# Altium project Brain_Stimulator.PrjPcb (part 2 of 2)

## Sheet Four_DDS.SchDoc
size A; SheetNumber: 11; SheetTotal: 16
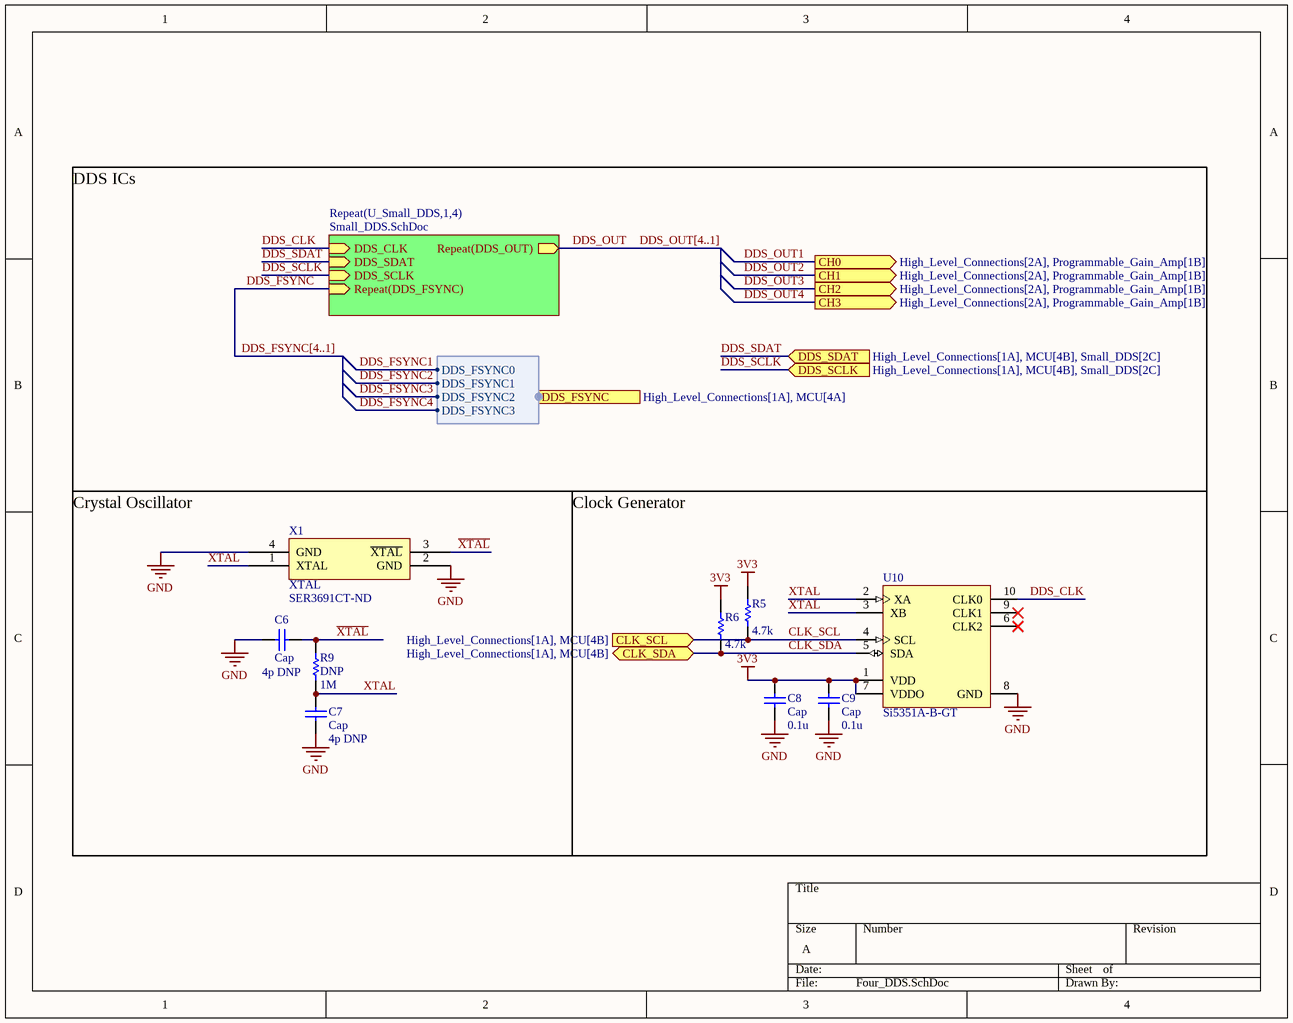
[diagram p11: Four_DDS.SchDoc]

### Parts
(Parts that share a designator on the sheet are numbered #1, #2 ... from top to bottom, then left to right.)
C6#2  Cap  value 4p DNP  [0402_Res]
C7#2  Cap  value 4p DNP  [0402_Res]
C8#2  Cap  value 0.1u  [0402_Res]
C9#2  Cap  value 0.1u  [0402_Res]
R5#2  value 4.7k  [0402_Res]  (hidden comment: DNP)
R6#2  value 4.7k  [0402_Res]  (hidden comment: DNP)
R9  DNP  value 1M  [0402_Res]
U10  Si5351A-B-GT  [SLAB-MSOP-10_N]
X1#2  XTAL  Supplier Part Number 1: SER3691CT-ND  [XTAL_Basic]

### Blocks framed on the sheet
Clock Generator: C8#2 C9#2 R5#2 R6#2 U10

### Sub-sheets
Repeat(U_Small_DDS,1,4) = Small_DDS.SchDoc: DDS_CLK (in), DDS_SDAT (in), DDS_SCLK (in), Repeat(DDS_FSYNC) (in), Repeat(DDS_OUT) (out)

### Ports
CH0 (out, see High_Level_Connections[2A], Programmable_Gain_Amp[1B]), CH1 (out, see High_Level_Connections[2A], Programmable_Gain_Amp[1B]), CH2 (out, see High_Level_Connections[2A], Programmable_Gain_Amp[1B]), CH3 (out, see High_Level_Connections[2A], Programmable_Gain_Amp[1B]), CLK_SCL (in, see High_Level_Connections[1A], MCU[4B]), CLK_SDA (bidir, see High_Level_Connections[1A], MCU[4B]), DDS_FSYNC (harness DDS_FSYNC, see High_Level_Connections[1A], MCU[4A]), DDS_SCLK (in, see High_Level_Connections[1A], MCU[4B], Small_DDS[2C]), DDS_SDAT (in, see High_Level_Connections[1A], MCU[4B], Small_DDS[2C])

### Harnesses
DDS_FSYNC: DDS_FSYNC0, DDS_FSYNC1, DDS_FSYNC2, DDS_FSYNC3

### Nets
3V3: C8#2.2 C9#2.2 R5#2.2 R6#2.2 U10.1(VDD) U10.7(VDDO)
GND: C6#2.1 C7#2.1 C8#2.1 C9#2.1 U10.8(GND) X1#2.2(GND) X1#2.4(GND)
~{XTAL}: C6#2.2 R9.2 U10.3(XB) X1#2.3(~{XTAL})
CLK_SCL: R5#2.1 U10.4(SCL) ; port CLK_SCL
CLK_SDA: R6#2.1 U10.5(SDA) ; port CLK_SDA
DDS_CLK: U10.10(CLK0) ; sheet Repeat(U_Small_DDS,1,4)/DDS_CLK
DDS_FSYNC: sheet Repeat(U_Small_DDS,1,4)/Repeat(DDS_FSYNC)
DDS_OUT: sheet Repeat(U_Small_DDS,1,4)/Repeat(DDS_OUT)
DDS_OUT1: port CH0
DDS_OUT2: port CH1
DDS_OUT3: port CH2
DDS_OUT4: port CH3
DDS_SCLK: port DDS_SCLK, sheet Repeat(U_Small_DDS,1,4)/DDS_SCLK
DDS_SDAT: port DDS_SDAT, sheet Repeat(U_Small_DDS,1,4)/DDS_SDAT
XTAL: C7#2.2 R9.1 U10.2(XA) X1#2.1(XTAL)

Not connected (* = marked no-connect by the designer): U10 6(CLK2)* 9(CLK1)*

### Buses and harness runs
bus DDS_FSYNC[4..1]
bus DDS_OUT[4..1]

### Notes on the sheet
- DDS ICs
- Crystal Oscillator

### Library data of the parts
C6#2 C7#2 C8#2 C9#2 = Cap: Capacitor; Published: 8-Jun-2000; LatestRevisionDate: 17-Jul-2002; LatestRevisionNote: Re-released for DXP Platform.; PackageReference: RAD-0.3; Publisher: Altium Limited; PackageDescription: Radial Cap, Thru-Hole; 2 Leads; 0.3 in Pin Spacing
R5#2 R6#2 R9 = Res1: Resistor; Published: 8-Jun-2000; LatestRevisionDate: 17-Jul-2002; LatestRevisionNote: Re-released for DXP Platform.; PackageReference: AXIAL-0.3; Publisher: Altium Limited; PackageDescription: Axial Device, Thru-Hole; 2 Leads; 0.3 in Pin Spacing
U10 = CMP-0510-00012-1: I2C-Programmable Any-Frequency CMOS Clock Generator + VCXO, 2.5 / 3.3 V, 0.008 to 160 MHz Output, -40 to 85 degC, 10-pin SOP; Manufacturer: Silicon Labs; Sub-Family: Clock Generators; VDD: 2.5 V; 3.3 V; Output Format: LVCMOS; Reference Inputs: 1; ComponentLink1URL: http://www.silabs.com/; Code_JEDEC: MO-187; PackageDescription: 10-Pin Mini Small Outline Package, Body 3 x 3 mm, Pitch 0.5 mm; Output Frequency (MHz): 0.008 to 160; ComponentLink3Description: Package Specification; DatasheetVersion: Rev. 0.95; PartNumber: Si5351A-B-GT; ComponentLink1Description: Manufacturer URL; Code_IPC: J-STD-020; Mounting Technology: Surface Mount; ComponentLink2Description: Datasheet; PackageReference: MSOP-10; ComponentLink2URL: http://www.silabs.com/Support%20Documents/TechnicalDocs/Si5351.pdf; ComponentLink3URL: http://www.silabs.com/Support Documents/TechnicalDocs/C8051T60x.pdf
X1#2 = XTAL: ComponentLink1Description: New link; ComponentLink1URL: *; Supplier 1: DigiKey

## Sheet Small_DDS.SchDoc
size A; SheetNumber: 12; SheetTotal: 16
Used 4 times, as channels U_High_Level_Connections/U_Four_DDS/U_Small_DDS1, U_High_Level_Connections/U_Four_DDS/U_Small_DDS2, U_High_Level_Connections/U_Four_DDS/U_Small_DDS3, U_High_Level_Connections/U_Four_DDS/U_Small_DDS4. Parts and nets are listed once, with the designators drawn on the sheet.
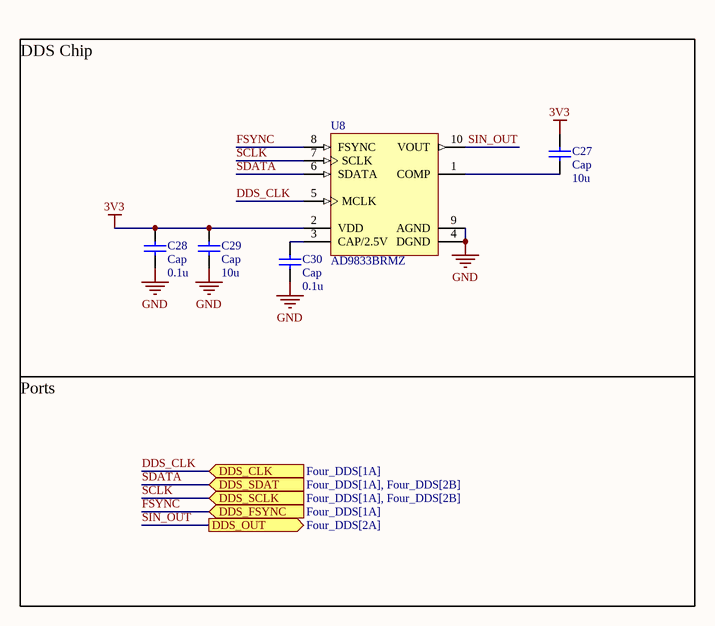
[diagram p12: Small_DDS.SchDoc]

### Parts
C27  Cap  value 10u  [0402_Res]
C28  Cap  value 0.1u  [0402_Res]
C29  Cap  value 10u  [0402_Res]
C30  Cap  value 0.1u  [0402_Res]
U8  AD9833BRMZ  [ADI-RM-10_M]

### Ports
DDS_CLK (in, see Four_DDS[1A]), DDS_FSYNC (in, see Four_DDS[1A]), DDS_OUT (out, see Four_DDS[2A]), DDS_SCLK (in, see Four_DDS[1A], Four_DDS[2B]), DDS_SDAT (in, see Four_DDS[1A], Four_DDS[2B])

### Nets
3V3: C27.2 C28.2 C29.2 U8.2(VDD)
GND: C28.1 C29.1 C30.1 U8.4(DGND) U8.9(AGND)
DDS_CLK: U8.5(MCLK) ; port DDS_CLK
FSYNC: U8.8(FSYNC) ; port DDS_FSYNC
SCLK: U8.7(SCLK) ; port DDS_SCLK
SDATA: U8.6(SDATA) ; port DDS_SDAT
SIN_OUT: U8.10(VOUT) ; port DDS_OUT
NetC27_1: C27.1 U8.1(COMP)
NetC30_2: C30.2 U8.3(CAP/2.5V)

### Channels
U_High_Level_Connections/U_Four_DDS/U_Small_DDS1: designators end in _U_Small_DDS1; ports DDS_CLK=DDS_CLK DDS_FSYNC=FSYNC DDS_OUT=SIN_OUT DDS_SCLK=DDS_SCLK DDS_SDAT=DDS_SDAT
U_High_Level_Connections/U_Four_DDS/U_Small_DDS2: designators end in _U_Small_DDS2; ports DDS_CLK=DDS_CLK DDS_FSYNC=FSYNC DDS_OUT=SIN_OUT DDS_SCLK=DDS_SCLK DDS_SDAT=DDS_SDAT
U_High_Level_Connections/U_Four_DDS/U_Small_DDS3: designators end in _U_Small_DDS3; ports DDS_CLK=DDS_CLK DDS_FSYNC=FSYNC DDS_OUT=SIN_OUT DDS_SCLK=DDS_SCLK DDS_SDAT=DDS_SDAT
U_High_Level_Connections/U_Four_DDS/U_Small_DDS4: designators end in _U_Small_DDS4; ports DDS_CLK=DDS_CLK DDS_FSYNC=FSYNC DDS_OUT=SIN_OUT DDS_SCLK=DDS_SCLK DDS_SDAT=DDS_SDAT

### Notes on the sheet
- DDS Chip
- Ports

### Library data of the parts
C27-C30 = Cap: Capacitor; Published: 8-Jun-2000; LatestRevisionDate: 17-Jul-2002; LatestRevisionNote: Re-released for DXP Platform.; PackageReference: RAD-0.3; Publisher: Altium Limited; PackageDescription: Radial Cap, Thru-Hole; 2 Leads; 0.3 in Pin Spacing
U8 = CMP-0293-00077-1: Low Power, 12.65 mW, 2.3 V to 5.5 V, Programmable Waveform Generator, 10-Bit, Serial, RM-10, 50 Tube, Pb-Free; Resolution (Bits): 10bit; Compliance Range (V): 650mV; FS Iout (mA nom): 3mA; REFCLK Multiplier: No; Master fclk: 25MHz; I Supply total (max): 5.5mA; Tuning Word Width (bits): 28bit; Code_JEDEC: MO-187-BA; DatasheetVersion: Rev. D; PackageVersion: 5/8/2005; ComponentLink1URL: www.analog.com; ComponentLink3Description: Package Specification; PackageDescription: 10-Lead Mini Small Outline Package [MSOP]; I/O Interface: Serial; ComponentLink2Description: Datasheet; ComponentLink1Description: Manufacturer URL; PackageReference: RM-10; ComponentLink2URL: http://www.analog.com/static/imported-files/data_sheets/AD9833.pdf; ComponentLink3URL: http://www.analog.com/static/imported-files/packages/PKG_PDF/MSOP%28RM%29/RM_10.pdf

## Sheet Curr_Source_Buffer.SchDoc
size A; SheetNumber: 15; SheetTotal: 16
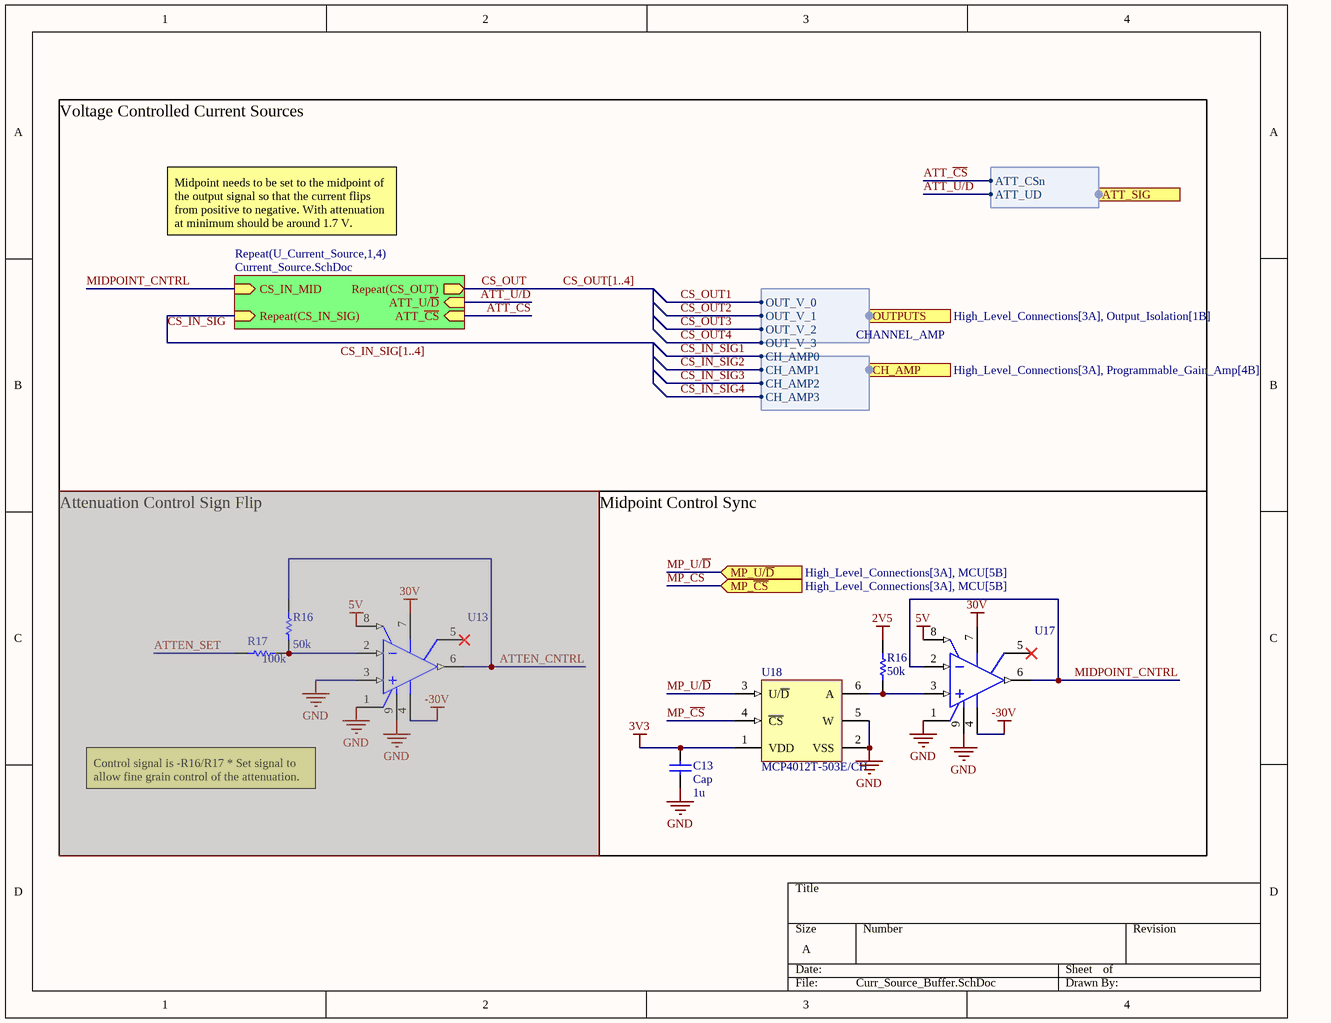
[diagram p13: Curr_Source_Buffer.SchDoc]

### Parts
(Parts that share a designator on the sheet are numbered #1, #2 ... from top to bottom, then left to right.)
C13#2  Cap  value 1u  [CAPC1608X05N]
R16#1  value 50k  [0402_Res]  (hidden comment: DNP)  (masked out: inside a compile mask, not in the netlist)
R16#2  value 50k  [0402_Res]  (hidden comment: DNP)
R17  value 100k  [0402_Res]  (hidden comment: DNP)  (masked out: inside a compile mask, not in the netlist)
U13#2  OPA454AIDDA  [DDA0008C_L]  (value not drawn)  (masked out: inside a compile mask, not in the netlist)
U17  OPA454AIDDA  [DDA0008C_L]  (value not drawn)
U18  MCP4012T-503E/CH  [SOT-23-CH6_M]

### Blocks framed on the sheet
Midpoint Control Sync: C13#2 R16#2 U17 U18

### Sub-sheets
Repeat(U_Current_Source,1,4) = Current_Source.SchDoc: CS_IN_MID (in), Repeat(CS_OUT) (out), Repeat(CS_IN_SIG) (in), ATT_U/~{D} (in), ATT_~{CS} (in)

### Ports
ATT_SIG (harness ATT), CH_AMP (in, harness CHANNEL_AMP, see High_Level_Connections[3A], Programmable_Gain_Amp[4B]), MP_U/~{D} (in, see High_Level_Connections[3A], MCU[5B]), MP_~{CS} (in, see High_Level_Connections[3A], MCU[5B]), OUTPUTS (harness OUTPUT_VOLTAGES, see High_Level_Connections[3A], Output_Isolation[1B])

### Harnesses
OUTPUT_VOLTAGES: OUT_V_0, OUT_V_1, OUT_V_2, OUT_V_3
CHANNEL_AMP: CH_AMP0, CH_AMP1, CH_AMP2, CH_AMP3
ATT: ATT_CSn, ATT_UD

### Nets
2V5: R16#2.1
3V3: C13#2.2 U18.1(VDD)
5V: U17.8(E/D)
30V: U17.7(V+)
-30V: U17.4(V-)
GND: C13#2.1 U17.1(E/D_COM) U17.9(EP) U18.2(VSS) U18.5(W)
ATT_~{CS}: sheet Repeat(U_Current_Source,1,4)/ATT_~{CS}, port ATT_SIG.ATT_CSn
ATT_U/~{D}: sheet Repeat(U_Current_Source,1,4)/ATT_U/~{D}, port ATT_SIG.ATT_UD
CS_IN_SIG: sheet Repeat(U_Current_Source,1,4)/Repeat(CS_IN_SIG)
CS_IN_SIG1: port CH_AMP.CH_AMP0  [project net CH_AMP1]
CS_IN_SIG2: port CH_AMP.CH_AMP1  [project net CH_AMP2]
CS_IN_SIG3: port CH_AMP.CH_AMP2  [project net CH_AMP3]
CS_IN_SIG4: port CH_AMP.CH_AMP3  [project net CH_AMP4]
CS_OUT: sheet Repeat(U_Current_Source,1,4)/Repeat(CS_OUT)
MIDPOINT_CNTRL: U17.2(IN-) U17.6(OUT) ; sheet Repeat(U_Current_Source,1,4)/CS_IN_MID
MP_~{CS}: U18.4(~{CS}) ; port MP_~{CS}
MP_U/~{D}: U18.3(U/~{D}) ; port MP_U/~{D}
NetR16#2_2: R16#2.2 U17.3(IN+) U18.6(A)

Not connected (* = marked no-connect by the designer): U17 5(STATUS_FLAG)*

### Buses and harness runs
bus CS_IN_SIG[1..4]
bus CS_OUT[1..4]

### Notes on the sheet
- Voltage Controlled Current Sources
- Midpoint needs to be set to the midpoint of the output signal so that the current flips from positive to negative. With attenuation at minimum should be around 1.7 V.
- Attenuation Control Sign Flip
- Control signal is -R16/R17 * Set signal to allow fine grain control of the attenuation.

### Library data of the parts
C13#2 = Cap: Capacitor; Published: 8-Jun-2000; LatestRevisionDate: 17-Jul-2002; LatestRevisionNote: Re-released for DXP Platform.; PackageReference: RAD-0.3; Publisher: Altium Limited; PackageDescription: Radial Cap, Thru-Hole; 2 Leads; 0.3 in Pin Spacing
R16#1 R16#2 R17 = Res1: Resistor; Published: 8-Jun-2000; LatestRevisionDate: 17-Jul-2002; LatestRevisionNote: Re-released for DXP Platform.; PackageReference: AXIAL-0.3; Publisher: Altium Limited; PackageDescription: Axial Device, Thru-Hole; 2 Leads; 0.3 in Pin Spacing
U13#2 U17 = CMP-0017-00714-2: High Voltage (100V), High-Current (50mA) Operational Amplifier, G=1 Stable, 10 to 100 V, -55 to 125 degC, 8-pin SOP (DDA8), Green (RoHS & no Sb/Br); Manufacturer: Texas Instruments; Number of Channels: 1; CMRR(Min)(dB): 100; Rating: Catalog; Total Supply Voltage(Min)(+5V is 5, +/-5V is 10): 10; Offset Drift(Typ)(uV/C): 1.6; Vn at 1kHz(Typ)(nV/rtHz): 47; Slew Rate(Typ)(V/us): 13; Sub Family: General Purpose Amplifier, High Output Current Amplifier (>=50mA), High Supply Voltage Amplifier (>=30V), Precision Amplifier; Iq per channel(Max)(mA): 4; GBW(Typ)(MHz): 2.5; Code_JEDEC: MS-012; ComponentLink3URL: http://www.ti.com/litv/pdf/mpds092e; ComponentLink1Description: Manufacturer URL; PackageDescription: 8-Pin PowerPAD(TM) Plastic Small Outline, Body 3.9 x 4.9 mm, Pitch 1.27 mm; PackageVersion: 4202561/F, 12/2011; ComponentLink3Description: Package Specification; ComponentLink2URL: http://www.ti.com/lit/ds/symlink/opa454.pdf; ComponentLink2Description: Datasheet; IIB(Max)(pA): 100; ComponentLink1URL: http://www.ti.com/; DatasheetVersion: SBOS391A; Total Supply Voltage(Max)(+5V is 5, +/-5V is 10): 100; Eco-Plan: Green (RoHS & no Sb/Br); Mounting Technology: Surface Mount; Vio (25C)(Max)(mV): 4; PackageReference: DDA0008C; PartNumber: OPA454AIDDA
U18 = CMP-0188-00744-2: Low-Cost 64-Step Volatile Digital POT, 6-Pin SOT-23, Extended Temperature, Tape and Reel; ComponentLink3Description: Package Specification; ComponentLink1Description: Manufacturer URL; PackageDescription: 6-Lead Plastic Small Outline Transistor (CH) [SOT-23]; ComponentLink2Description: Datasheet; ComponentLink3URL: http://www.microchip.com/stellent/groups/techpub_sg/documents/packagingspec/en012702.pdf; DatasheetVersion: revC, Dec-2006; PackageVersion: revBB, Aug-2009; Code_IPC: SOT26A-6; PackageReference: SOT-23-CH6; RevisionNote: URLs added.; ComponentLink2URL: http://ww1.microchip.com/downloads/en/DeviceDoc/21978c.pdf; ComponentLink1URL: http://www.microchip.com/

## Sheet Current_Source.SchDoc
size A; SheetNumber: 16; SheetTotal: 16
Used 4 times, as channels U_High_Level_Connections/U_Curr_Source_Buffer/U_Current_Source1, U_High_Level_Connections/U_Curr_Source_Buffer/U_Current_Source2, U_High_Level_Connections/U_Curr_Source_Buffer/U_Current_Source3, U_High_Level_Connections/U_Curr_Source_Buffer/U_Current_Source4. Parts and nets are listed once, with the designators drawn on the sheet.
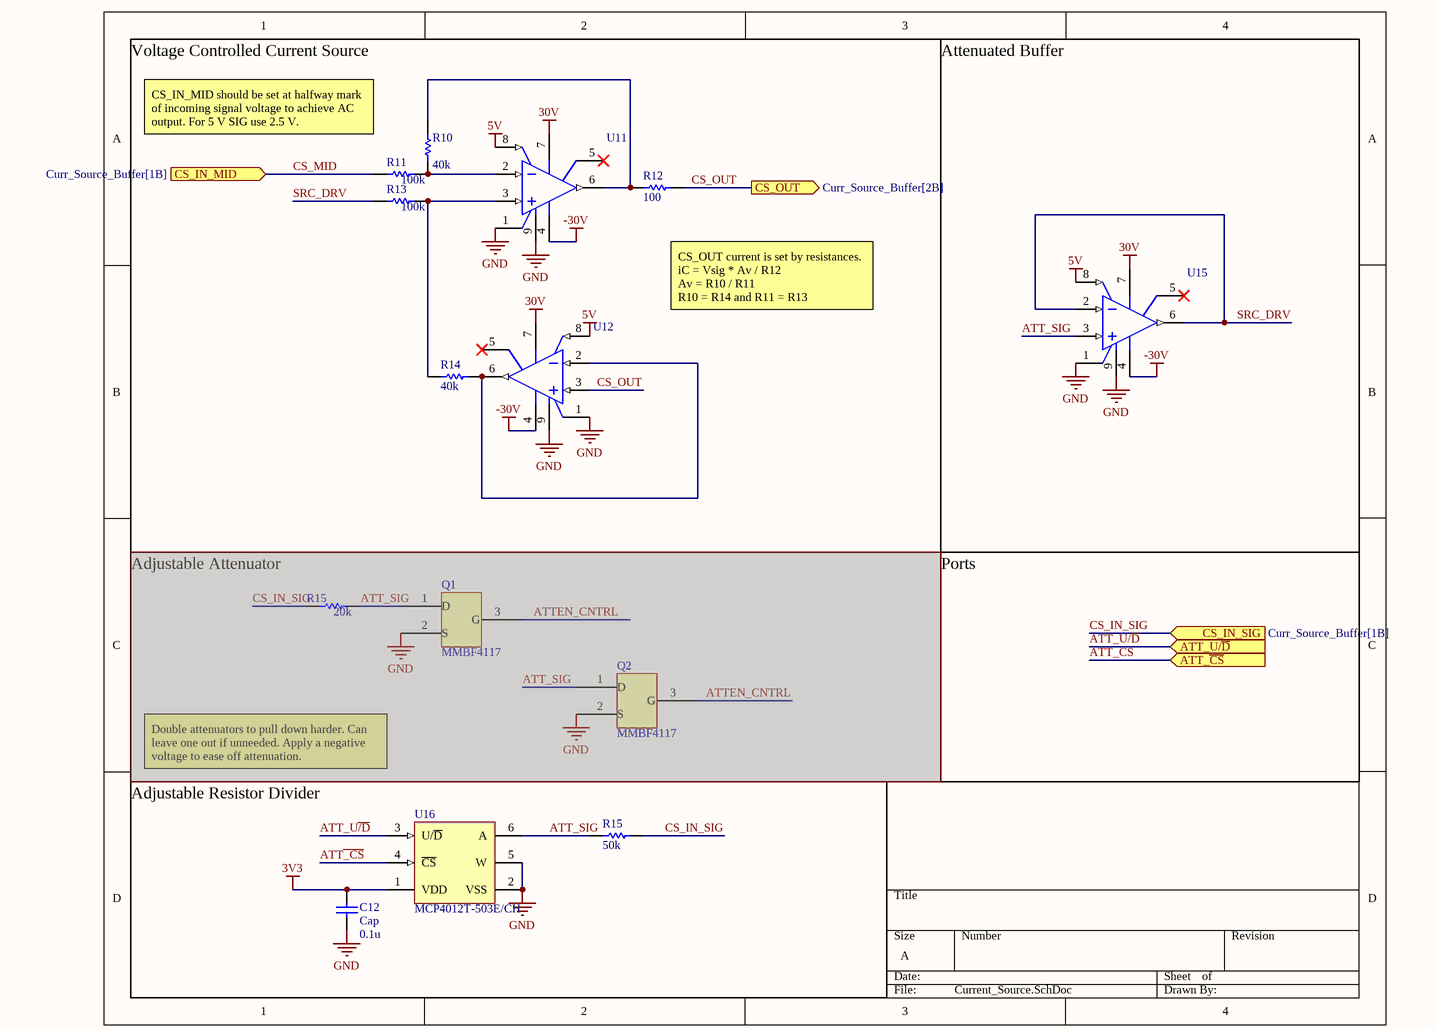
[diagram p14: Current_Source.SchDoc]

### Parts
(Parts that share a designator on the sheet are numbered #1, #2 ... from top to bottom, then left to right.)
C12  Cap  value 0.1u  [CAPC1608X05N]
Q1  Attenuator JFET  [MMBF4117]  (value not drawn)  (masked out: inside a compile mask, not in the netlist)
Q2  Attenuator JFET  [MMBF4117]  (value not drawn)  (masked out: inside a compile mask, not in the netlist)
R10  value 40k  [0402_Res]  (hidden comment: DNP)
R11  value 100k  [0402_Res]  (hidden comment: DNP)
R12  value 100  [0402_Res]  (hidden comment: DNP)
R13  value 100k  [0402_Res]  (hidden comment: DNP)
R14  value 40k  [0402_Res]  (hidden comment: DNP)
R15#1  value 20k  [0402_Res]  (hidden comment: DNP)  (masked out: inside a compile mask, not in the netlist)
R15#2  value 50k  [0402_Res]  (hidden comment: DNP)
U11  OPA454AIDDA  [DDA0008C_L]  (value not drawn)
U12  OPA454AIDDA  [DDA0008C_L]  (value not drawn)
U15  OPA454AIDDA  [DDA0008C_L]  (value not drawn)
U16  MCP4012T-503E/CH  [SOT-23-CH6_M]

### Blocks framed on the sheet
Adjustable Resistor Divider: C12 R15#2 U16

### Ports
ATT_U/~{D} (in), ATT_~{CS} (in), CS_IN_MID (in, see Curr_Source_Buffer[1B]), CS_IN_SIG (in, see Curr_Source_Buffer[1B]), CS_OUT (out, see Curr_Source_Buffer[2B])

### Nets
3V3: C12.2 U16.1(VDD)
5V: U11.8(E/D) U12.8(E/D) U15.8(E/D)
30V: U11.7(V+) U12.7(V+) U15.7(V+)
-30V: U11.4(V-) U12.4(V-) U15.4(V-)
GND: C12.1 U11.1(E/D_COM) U11.9(EP) U12.1(E/D_COM) U12.9(EP) U15.1(E/D_COM) U15.9(EP) U16.2(VSS) U16.5(W)
ATT~{_CS}: U16.4(~{CS})
ATT_~{CS}: port ATT_~{CS}
ATT_SIG: R15#2.2 U15.3(IN+) U16.6(A)
ATT_U~{/D}: U16.3(U/~{D})
ATT_U/~{D}: port ATT_U/~{D}
CS_IN_SIG: R15#2.1 ; port CS_IN_SIG
CS_MID: R11.2 ; port CS_IN_MID
CS_OUT: R12.1 U12.3(IN+) ; port CS_OUT
SRC_DRV: R13.2 U15.2(IN-) U15.6(OUT)
NetR10_1: R10.1 R11.1 U11.2(IN-)
NetR10_2: R10.2 R12.2 U11.6(OUT)
NetR13_1: R13.1 R14.2 U11.3(IN+)
NetR14_1: R14.1 U12.2(IN-) U12.6(OUT)

Not connected (* = marked no-connect by the designer): U11 5(STATUS_FLAG)*; U12 5(STATUS_FLAG)*; U15 5(STATUS_FLAG)*

### Channels
U_High_Level_Connections/U_Curr_Source_Buffer/U_Current_Source1: designators C12=C12_U_Current_Source1 Q1=Q1_U_Current_Source1 Q2=Q2_U_Current_Source1 R10=R10_U_Current_Source1 R11=R11_U_Current_Source1 R12=R12_U_Current_Source1 R13=R13_U_Current_Source1 R14=R14_U_Current_Source1 R15=R15_U_Current_Source1#1 R15=R15_U_Current_Source1#2 U11=U11_U_Current_Source1 U12=U12_U_Current_Source1 U15=U15_U_Current_Source1 U16=U16_U_Current_Source1; ports ATT_U/~{D}=ATT_U/~{D}_U_Current_Source1 ATT_~{CS}=ATT_~{CS}_U_Current_Source1 CS_IN_MID=CS_MID CS_IN_SIG=CS_IN_SIG CS_OUT=CS_OUT
U_High_Level_Connections/U_Curr_Source_Buffer/U_Current_Source2: designators C12=C12_U_Current_Source2 Q1=Q1_U_Current_Source2 Q2=Q2_U_Current_Source2 R10=R10_U_Current_Source2 R11=R11_U_Current_Source2 R12=R12_U_Current_Source2 R13=R13_U_Current_Source2 R14=R14_U_Current_Source2 R15=R15_U_Current_Source2#1 R15=R15_U_Current_Source2#2 U11=U11_U_Current_Source2 U12=U12_U_Current_Source2 U15=U15_U_Current_Source2 U16=U16_U_Current_Source2; ports ATT_U/~{D}=ATT_U/~{D}_U_Current_Source1 ATT_~{CS}=ATT_~{CS}_U_Current_Source1 CS_IN_MID=CS_MID CS_IN_SIG=CS_IN_SIG CS_OUT=CS_OUT
U_High_Level_Connections/U_Curr_Source_Buffer/U_Current_Source3: designators C12=C12_U_Current_Source3 Q1=Q1_U_Current_Source3 Q2=Q2_U_Current_Source3 R10=R10_U_Current_Source3 R11=R11_U_Current_Source3 R12=R12_U_Current_Source3 R13=R13_U_Current_Source3 R14=R14_U_Current_Source3 R15=R15_U_Current_Source3#1 R15=R15_U_Current_Source3#2 U11=U11_U_Current_Source3 U12=U12_U_Current_Source3 U15=U15_U_Current_Source3 U16=U16_U_Current_Source3; ports ATT_U/~{D}=ATT_U/~{D}_U_Current_Source1 ATT_~{CS}=ATT_~{CS}_U_Current_Source1 CS_IN_MID=CS_MID CS_IN_SIG=CS_IN_SIG CS_OUT=CS_OUT
U_High_Level_Connections/U_Curr_Source_Buffer/U_Current_Source4: designators C12=C12_U_Current_Source4 Q1=Q1_U_Current_Source4 Q2=Q2_U_Current_Source4 R10=R10_U_Current_Source4 R11=R11_U_Current_Source4 R12=R12_U_Current_Source4 R13=R13_U_Current_Source4 R14=R14_U_Current_Source4 R15=R15_U_Current_Source4#1 R15=R15_U_Current_Source4#2 U11=U11_U_Current_Source4 U12=U12_U_Current_Source4 U15=U15_U_Current_Source4 U16=U16_U_Current_Source4; ports ATT_U/~{D}=ATT_U/~{D}_U_Current_Source1 ATT_~{CS}=ATT_~{CS}_U_Current_Source1 CS_IN_MID=CS_MID CS_IN_SIG=CS_IN_SIG CS_OUT=CS_OUT

### Notes on the sheet
- Voltage Controlled Current Source
- Attenuated Buffer
- CS_IN_MID should be set at halfway mark of incoming signal voltage to achieve AC output. For 5 V SIG use 2.5 V.
- CS_OUT current is set by resistances.
  iC = Vsig * Av / R12
  Av = R10 / R11
  R10 = R14 and R11 = R13
- (near R15#1) Adjustable Attenuator
- Ports
- Double attenuators to pull down harder. Can leave one out if unneeded. Apply a negative voltage to ease off attenuation.
- (in symbol MMBF4117) D; G; S

### Library data of the parts
C12 = Cap: Capacitor; Published: 8-Jun-2000; LatestRevisionDate: 17-Jul-2002; LatestRevisionNote: Re-released for DXP Platform.; PackageReference: RAD-0.3; Publisher: Altium Limited; PackageDescription: Radial Cap, Thru-Hole; 2 Leads; 0.3 in Pin Spacing
Q1 Q2 = MMBF4117: Supplier 1: Arrow Electronics; Supplier Part Number 1: MMBF4117
R10-R14 R15#1 R15#2 = Res1: Resistor; Published: 8-Jun-2000; LatestRevisionDate: 17-Jul-2002; LatestRevisionNote: Re-released for DXP Platform.; PackageReference: AXIAL-0.3; Publisher: Altium Limited; PackageDescription: Axial Device, Thru-Hole; 2 Leads; 0.3 in Pin Spacing
U11 U12 U15 = CMP-0017-00714-2: as U13#2 on sheet Curr_Source_Buffer; Code_JEDEC: MS-012; ComponentLink3URL: http://www.ti.com/litv/pdf/mpds092e; ComponentLink1Description: Manufacturer URL; PackageDescription: 8-Pin PowerPAD(TM) Plastic Small Outline, Body 3.9 x 4.9 mm, Pitch 1.27 mm; PackageVersion: 4202561/F, 12/2011; ComponentLink3Description: Package Specification; ComponentLink2URL: http://www.ti.com/lit/ds/symlink/opa454.pdf; ComponentLink2Description: Datasheet; IIB(Max)(pA): 100; ComponentLink1URL: http://www.ti.com/; DatasheetVersion: SBOS391A; Total Supply Voltage(Max)(+5V is 5, +/-5V is 10): 100; Eco-Plan: Green (RoHS & no Sb/Br); Mounting Technology: Surface Mount; Vio (25C)(Max)(mV): 4; PackageReference: DDA0008C; PartNumber: OPA454AIDDA
U16 = CMP-0188-00744-2: as U18 on sheet Curr_Source_Buffer; ComponentLink3Description: Package Specification; ComponentLink1Description: Manufacturer URL; PackageDescription: 6-Lead Plastic Small Outline Transistor (CH) [SOT-23]; ComponentLink2Description: Datasheet; ComponentLink3URL: http://www.microchip.com/stellent/groups/techpub_sg/documents/packagingspec/en012702.pdf; DatasheetVersion: revC, Dec-2006; PackageVersion: revBB, Aug-2009; Code_IPC: SOT26A-6; PackageReference: SOT-23-CH6; RevisionNote: URLs added.; ComponentLink2URL: http://ww1.microchip.com/downloads/en/DeviceDoc/21978c.pdf; ComponentLink1URL: http://www.microchip.com/

## Sheet MCU.SchDoc
size 420 x 297 mm; SheetNumber: 3; SheetTotal: 16
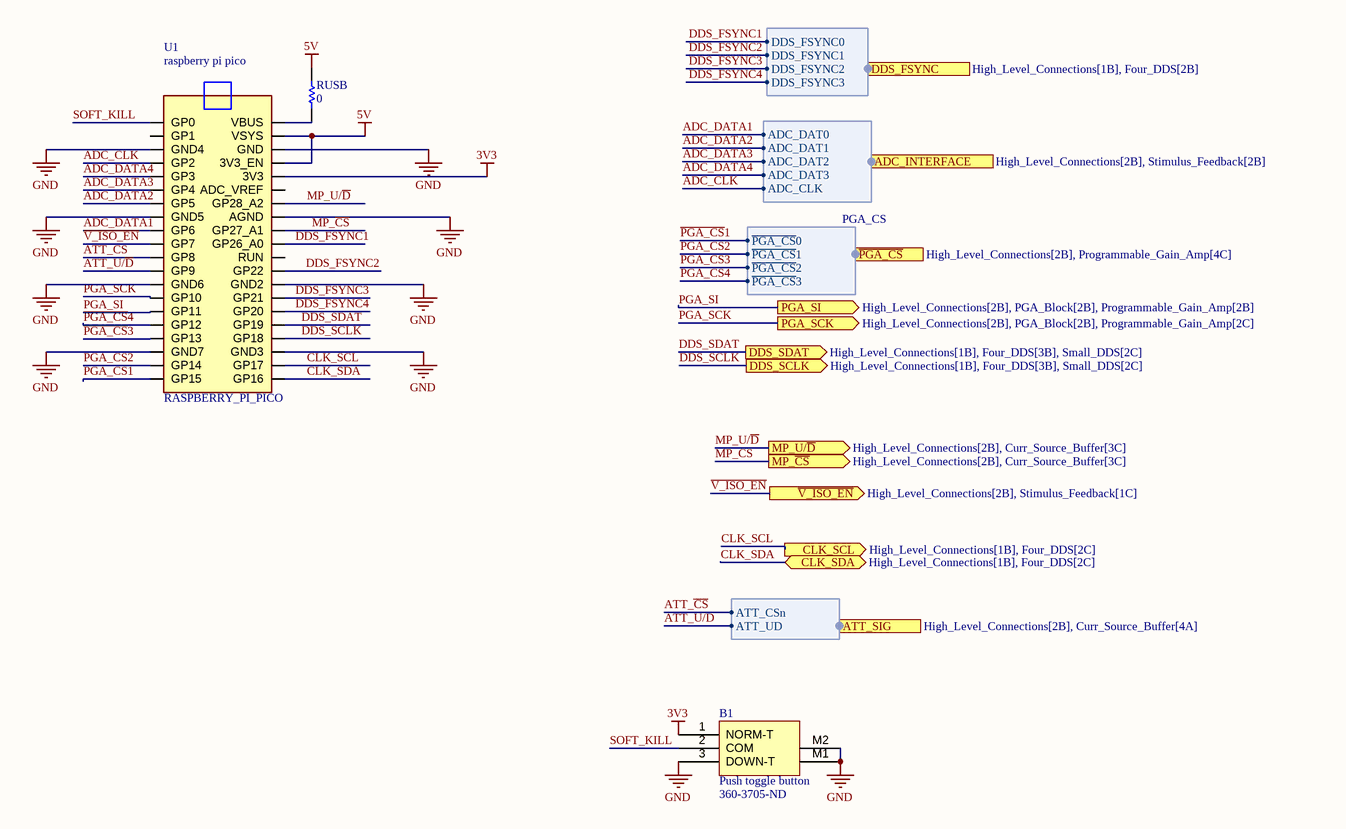
[diagram p15: MCU.SchDoc]

### Parts
(Parts that share a designator on the sheet are numbered #1, #2 ... from top to bottom, then left to right.)
B1  Push toggle button  Supplier Part Number 1: 360-3705-ND  [BB16AH-FA]
RUSB  value 0  [0402_Res]  (hidden comment: DNP)
U1#2  RASPBERRY_PI_PICO  [RASPBERRY_PI_PICO]

### Ports
ADC_INTERFACE (harness ADC_DATA, see High_Level_Connections[2B], Stimulus_Feedback[2B]), ATT_SIG (harness ATT, see High_Level_Connections[2B], Curr_Source_Buffer[4A]), CLK_SCL (out, see High_Level_Connections[1B], Four_DDS[2C]), CLK_SDA (bidir, see High_Level_Connections[1B], Four_DDS[2C]), DDS_FSYNC (harness DDS_FSYNC, see High_Level_Connections[1B], Four_DDS[2B]), DDS_SCLK (out, see High_Level_Connections[1B], Four_DDS[3B], Small_DDS[2C]), DDS_SDAT (out, see High_Level_Connections[1B], Four_DDS[3B], Small_DDS[2C]), MP_U/~{D} (out, see High_Level_Connections[2B], Curr_Source_Buffer[3C]), MP_~{CS} (out, see High_Level_Connections[2B], Curr_Source_Buffer[3C]), PGA_SCK (out, see High_Level_Connections[2B], PGA_Block[2B], Programmable_Gain_Amp[2C]), PGA_SI (out, see High_Level_Connections[2B], PGA_Block[2B], Programmable_Gain_Amp[2B]), ~{PGA_CS} (in, harness PGA_CS, see High_Level_Connections[2B], Programmable_Gain_Amp[4C]), ~{V_ISO_EN} (out, see High_Level_Connections[2B], Stimulus_Feedback[1C])

### Harnesses
ADC_DATA: ADC_DAT0, ADC_DAT1, ADC_DAT2, ADC_DAT3, ADC_CLK
PGA_CS: ~{PGA_CS}0, ~{PGA_CS}1, ~{PGA_CS}2, ~{PGA_CS}3
DDS_FSYNC: DDS_FSYNC0, DDS_FSYNC1, DDS_FSYNC2, DDS_FSYNC3
ATT: ATT_CSn, ATT_UD

### Nets
3V3: B1.1(NORM-T) U1#2.3V3
5V: RUSB.1 U1#2.3V3_EN U1#2.VSYS
GND: B1.3(DOWN-T) B1.M1 B1.M2 U1#2.AGND U1#2.GND U1#2.GND2 U1#2.GND3 U1#2.GND4 U1#2.GND5 U1#2.GND6 U1#2.GND7
~{PGA_CS}1: U1#2.GP15 ; port ~{PGA_CS}.~{PGA_CS}0
~{PGA_CS}2: U1#2.GP14 ; port ~{PGA_CS}.~{PGA_CS}1
~{PGA_CS}3: U1#2.GP13 ; port ~{PGA_CS}.~{PGA_CS}2
~{PGA_CS}4: U1#2.GP12 ; port ~{PGA_CS}.~{PGA_CS}3
~{V_ISO_EN}: U1#2.GP7 ; port ~{V_ISO_EN}
ADC_CLK: U1#2.GP2 ; port ADC_INTERFACE.ADC_CLK
ADC_DATA1: U1#2.GP6 ; port ADC_INTERFACE.ADC_DAT0
ADC_DATA2: U1#2.GP5 ; port ADC_INTERFACE.ADC_DAT1
ADC_DATA3: U1#2.GP4 ; port ADC_INTERFACE.ADC_DAT2
ADC_DATA4: U1#2.GP3 ; port ADC_INTERFACE.ADC_DAT3
ATT_~{CS}: U1#2.GP8 ; port ATT_SIG.ATT_CSn
ATT_U/~{D}: U1#2.GP9 ; port ATT_SIG.ATT_UD
CLK_SCL: U1#2.GP17 ; port CLK_SCL
CLK_SDA: U1#2.GP16 ; port CLK_SDA
DDS_FSYNC1: U1#2.GP26_A0 ; port DDS_FSYNC.DDS_FSYNC0
DDS_FSYNC2: U1#2.GP22 ; port DDS_FSYNC.DDS_FSYNC1
DDS_FSYNC3: U1#2.GP21 ; port DDS_FSYNC.DDS_FSYNC2
DDS_FSYNC4: U1#2.GP20 ; port DDS_FSYNC.DDS_FSYNC3
DDS_SCLK: U1#2.GP18 ; port DDS_SCLK
DDS_SDAT: U1#2.GP19 ; port DDS_SDAT
MP_~{CS}: U1#2.GP27_A1 ; port MP_~{CS}
MP_U/~{D}: U1#2.GP28_A2 ; port MP_U/~{D}
PGA_SCK: U1#2.GP10 ; port PGA_SCK
PGA_SI: U1#2.GP11 ; port PGA_SI
SOFT_KILL: B1.2(COM) U1#2.GP0
NetRUSB_2: RUSB.2 U1#2.VBUS

Not connected (* = marked no-connect by the designer): U1#2 ADC_VREF GP1 RUN

### Notes on the sheet
- THIS DOCUMENT AND THE DATA DISCLOSED HEREIN OR
- HEREWITH IS THE PROPERTY OF ALTIUM LIMITED AND MAY
- DWG NO:
- REVISION
- REV:
- DESCRIPTION
- DATE
- APPROVED
- BE FREELY DISTRIBUTED IN WHOLE. NO RIGHTS ARE
- RESERVED OR EXPRESS OR IMPLIED WARANTEE GIVEN.
- ENG:
- APPROVALS
- PROJECT
- DSN:
- CHK:
- REFERENCE DOCUMENTS
- PROJECT REVISION:
- TITLE
- DOCUMENT REVISION:
- DESIGN ITEM:
- BOM:
- FAB DWG:
- PCB DWG:
- ASSY DWG:
- SCALE:
- A3
- SIZE
- CAGE CODE
- FILE NAME
- DWG NO.
- SHEET
- OF
- REV
- (in symbol RASPBERRY_PI_PICO) raspberry pi pico

### Library data of the parts
B1 = BB16AH-FA: Supplier 1: DigiKey
RUSB = Res1: Resistor; Published: 8-Jun-2000; LatestRevisionDate: 17-Jul-2002; LatestRevisionNote: Re-released for DXP Platform.; PackageReference: AXIAL-0.3; Publisher: Altium Limited; PackageDescription: Axial Device, Thru-Hole; 2 Leads; 0.3 in Pin Spacing
U1#2 = RASPBERRY_PI_PICO: Raspberry Pi Board, Arm Cortex-M0+; Core Architecture:Arm; Core Sub-Architecture:Cortex-M0+; Kit Contents:Raspberry Pi Pico Board; No. Of Bits:32Bit; Silicon Core Number:Rp2040; Silicon Manufacturer:Raspberry Pi |Raspberry-Pi RASPBERRY PI PICO; SnapEDA_Link: https://www.snapeda.com/parts/RASPBERRY%20PI%20PICO/Raspberry+Pi/view-part/?ref=snap; Package: None; Value: *; MF: Raspberry Pi; MP: RASPBERRY PI PICO; Check_prices: https://www.snapeda.com/parts/RASPBERRY%20PI%20PICO/Raspberry+Pi/view-part/?ref=eda

## Nets that join several sheets
2V5: Non_Isolated_Sources (C11#1.2 U13#1.2), Curr_Source_Buffer (R16#2.1)
3V3: Non_Isolated_Sources (5 pins), Stimulus_Feedback (C23.2 C24.2 U7.3), U_High_Level_Connections/U_Stimulus_Feedback/U_Current_Measure1 (C15_U_Current_Measure1.2 U2_U_Current_Measure1.8), U_High_Level_Connections/U_Stimulus_Feedback/U_Current_Measure2 (C15_U_Current_Measure2.2 U2_U_Current_Measure2.8), U_High_Level_Connections/U_Stimulus_Feedback/U_Current_Measure3 (C15_U_Current_Measure3.2 U2_U_Current_Measure3.8), U_High_Level_Connections/U_Stimulus_Feedback/U_Current_Measure4 (C15_U_Current_Measure4.2 U2_U_Current_Measure4.8), Four_DDS (6 pins), U_High_Level_Connections/U_Four_DDS/U_Small_DDS1 (C27_U_Small_DDS1.2 C28_U_Small_DDS1.2 C29_U_Small_DDS1.2 U8_U_Small_DDS1.2), U_High_Level_Connections/U_Four_DDS/U_Small_DDS2 (C27_U_Small_DDS2.2 C28_U_Small_DDS2.2 C29_U_Small_DDS2.2 U8_U_Small_DDS2.2), U_High_Level_Connections/U_Four_DDS/U_Small_DDS3 (C27_U_Small_DDS3.2 C28_U_Small_DDS3.2 C29_U_Small_DDS3.2 U8_U_Small_DDS3.2), U_High_Level_Connections/U_Four_DDS/U_Small_DDS4 (C27_U_Small_DDS4.2 C28_U_Small_DDS4.2 C29_U_Small_DDS4.2 U8_U_Small_DDS4.2), Curr_Source_Buffer (C13#2.2 U18.1), U_High_Level_Connections/U_Curr_Source_Buffer/U_Current_Source1 (C12_U_Current_Source1.2 U16_U_Current_Source1.1), U_High_Level_Connections/U_Curr_Source_Buffer/U_Current_Source2 (C12_U_Current_Source2.2 U16_U_Current_Source2.1), U_High_Level_Connections/U_Curr_Source_Buffer/U_Current_Source3 (C12_U_Current_Source3.2 U16_U_Current_Source3.1), U_High_Level_Connections/U_Curr_Source_Buffer/U_Current_Source4 (C12_U_Current_Source4.2 U16_U_Current_Source4.1), MCU (B1.1 U1#2.3V3)
3V3_A: Stimulus_Feedback (C25.2 C26.2 U7.6), U_High_Level_Connections/U_Stimulus_Feedback/U_Current_Measure1 (C14_U_Current_Measure1.2 U2_U_Current_Measure1.1), U_High_Level_Connections/U_Stimulus_Feedback/U_Current_Measure2 (C14_U_Current_Measure2.2 U2_U_Current_Measure2.1), U_High_Level_Connections/U_Stimulus_Feedback/U_Current_Measure3 (C14_U_Current_Measure3.2 U2_U_Current_Measure3.1), U_High_Level_Connections/U_Stimulus_Feedback/U_Current_Measure4 (C14_U_Current_Measure4.2 U2_U_Current_Measure4.1)
5V: Non_Isolated_Sources (C21.2 U5.2 U5.4), U_High_Level_Connections/U_Programmable_Gain_Amp/U_PGA_Block1 (C22_U_PGA_Block1.2 U6_U_PGA_Block1.8), U_High_Level_Connections/U_Programmable_Gain_Amp/U_PGA_Block2 (C22_U_PGA_Block2.2 U6_U_PGA_Block2.8), U_High_Level_Connections/U_Programmable_Gain_Amp/U_PGA_Block3 (C22_U_PGA_Block3.2 U6_U_PGA_Block3.8), U_High_Level_Connections/U_Programmable_Gain_Amp/U_PGA_Block4 (C22_U_PGA_Block4.2 U6_U_PGA_Block4.8), Curr_Source_Buffer (U17.8), U_High_Level_Connections/U_Curr_Source_Buffer/U_Current_Source1 (U11_U_Current_Source1.8 U12_U_Current_Source1.8 U15_U_Current_Source1.8), U_High_Level_Connections/U_Curr_Source_Buffer/U_Current_Source2 (U11_U_Current_Source2.8 U12_U_Current_Source2.8 U15_U_Current_Source2.8), U_High_Level_Connections/U_Curr_Source_Buffer/U_Current_Source3 (U11_U_Current_Source3.8 U12_U_Current_Source3.8 U15_U_Current_Source3.8), U_High_Level_Connections/U_Curr_Source_Buffer/U_Current_Source4 (U11_U_Current_Source4.8 U12_U_Current_Source4.8 U15_U_Current_Source4.8), MCU (RUSB.1 U1#2.3V3_EN U1#2.VSYS)
12V: Non_Isolated_Sources (C20.2 U5.3), Flyback (6 pins), Battery_Connections (U14.3)
30V: Flyback (C2#2.1 D1.1 D2.1), Curr_Source_Buffer (U17.7), U_High_Level_Connections/U_Curr_Source_Buffer/U_Current_Source1 (U11_U_Current_Source1.7 U12_U_Current_Source1.7 U15_U_Current_Source1.7), U_High_Level_Connections/U_Curr_Source_Buffer/U_Current_Source2 (U11_U_Current_Source2.7 U12_U_Current_Source2.7 U15_U_Current_Source2.7), U_High_Level_Connections/U_Curr_Source_Buffer/U_Current_Source3 (U11_U_Current_Source3.7 U12_U_Current_Source3.7 U15_U_Current_Source3.7), U_High_Level_Connections/U_Curr_Source_Buffer/U_Current_Source4 (U11_U_Current_Source4.7 U12_U_Current_Source4.7 U15_U_Current_Source4.7)
-30V: Flyback (C4#2.2 D3.2 D4.2), Curr_Source_Buffer (U17.4), U_High_Level_Connections/U_Curr_Source_Buffer/U_Current_Source1 (U11_U_Current_Source1.4 U12_U_Current_Source1.4 U15_U_Current_Source1.4), U_High_Level_Connections/U_Curr_Source_Buffer/U_Current_Source2 (U11_U_Current_Source2.4 U12_U_Current_Source2.4 U15_U_Current_Source2.4), U_High_Level_Connections/U_Curr_Source_Buffer/U_Current_Source3 (U11_U_Current_Source3.4 U12_U_Current_Source3.4 U15_U_Current_Source3.4), U_High_Level_Connections/U_Curr_Source_Buffer/U_Current_Source4 (U11_U_Current_Source4.4 U12_U_Current_Source4.4 U15_U_Current_Source4.4)
AGND: Stimulus_Feedback (5 pins), U_High_Level_Connections/U_Stimulus_Feedback/U_Current_Measure1 (C14_U_Current_Measure1.1 U2_U_Current_Measure1.4 U2_U_Current_Measure1.9), U_High_Level_Connections/U_Stimulus_Feedback/U_Current_Measure2 (C14_U_Current_Measure2.1 U2_U_Current_Measure2.4 U2_U_Current_Measure2.9), U_High_Level_Connections/U_Stimulus_Feedback/U_Current_Measure3 (C14_U_Current_Measure3.1 U2_U_Current_Measure3.4 U2_U_Current_Measure3.9), U_High_Level_Connections/U_Stimulus_Feedback/U_Current_Measure4 (C14_U_Current_Measure4.1 U2_U_Current_Measure4.4 U2_U_Current_Measure4.9)
GND: Non_Isolated_Sources (9 pins), U_High_Level_Connections/U_Programmable_Gain_Amp/U_PGA_Block1 (C22_U_PGA_Block1.1 U6_U_PGA_Block1.3 U6_U_PGA_Block1.4), U_High_Level_Connections/U_Programmable_Gain_Amp/U_PGA_Block2 (C22_U_PGA_Block2.1 U6_U_PGA_Block2.3 U6_U_PGA_Block2.4), U_High_Level_Connections/U_Programmable_Gain_Amp/U_PGA_Block3 (C22_U_PGA_Block3.1 U6_U_PGA_Block3.3 U6_U_PGA_Block3.4), U_High_Level_Connections/U_Programmable_Gain_Amp/U_PGA_Block4 (C22_U_PGA_Block4.1 U6_U_PGA_Block4.3 U6_U_PGA_Block4.4), Output_Isolation (12 pins), Stimulus_Feedback (5 pins), U_High_Level_Connections/U_Stimulus_Feedback/U_Current_Measure1 (C15_U_Current_Measure1.1 U2_U_Current_Measure1.5 U2_U_Current_Measure1.10), U_High_Level_Connections/U_Stimulus_Feedback/U_Current_Measure2 (C15_U_Current_Measure2.1 U2_U_Current_Measure2.5 U2_U_Current_Measure2.10), U_High_Level_Connections/U_Stimulus_Feedback/U_Current_Measure3 (C15_U_Current_Measure3.1 U2_U_Current_Measure3.5 U2_U_Current_Measure3.10), U_High_Level_Connections/U_Stimulus_Feedback/U_Current_Measure4 (C15_U_Current_Measure4.1 U2_U_Current_Measure4.5 U2_U_Current_Measure4.10), Flyback (10 pins), Battery_Connections (5 pins), Four_DDS (7 pins), U_High_Level_Connections/U_Four_DDS/U_Small_DDS1 (5 pins), U_High_Level_Connections/U_Four_DDS/U_Small_DDS2 (5 pins), U_High_Level_Connections/U_Four_DDS/U_Small_DDS3 (5 pins), U_High_Level_Connections/U_Four_DDS/U_Small_DDS4 (5 pins), Curr_Source_Buffer (5 pins), U_High_Level_Connections/U_Curr_Source_Buffer/U_Current_Source1 (9 pins), U_High_Level_Connections/U_Curr_Source_Buffer/U_Current_Source2 (9 pins), U_High_Level_Connections/U_Curr_Source_Buffer/U_Current_Source3 (9 pins), U_High_Level_Connections/U_Curr_Source_Buffer/U_Current_Source4 (9 pins), MCU (11 pins)
~{V_ISO_EN}: Stimulus_Feedback (R8.2 U7.1), MCU (U1#2.GP7)
ADC_CLK: U_High_Level_Connections/U_Stimulus_Feedback/U_Current_Measure1 (U2_U_Current_Measure1.7), U_High_Level_Connections/U_Stimulus_Feedback/U_Current_Measure2 (U2_U_Current_Measure2.7), U_High_Level_Connections/U_Stimulus_Feedback/U_Current_Measure3 (U2_U_Current_Measure3.7), U_High_Level_Connections/U_Stimulus_Feedback/U_Current_Measure4 (U2_U_Current_Measure4.7)
ADC_DATA: U_High_Level_Connections/U_Stimulus_Feedback/U_Current_Measure1 (U2_U_Current_Measure1.6), U_High_Level_Connections/U_Stimulus_Feedback/U_Current_Measure2 (U2_U_Current_Measure2.6), U_High_Level_Connections/U_Stimulus_Feedback/U_Current_Measure3 (U2_U_Current_Measure3.6), U_High_Level_Connections/U_Stimulus_Feedback/U_Current_Measure4 (U2_U_Current_Measure4.6)
CLK_SCL: Four_DDS (R5#2.1 U10.4), MCU (U1#2.GP17)
CLK_SDA: Four_DDS (R6#2.1 U10.5), MCU (U1#2.GP16)
CS_IN_SIG: U_High_Level_Connections/U_Curr_Source_Buffer/U_Current_Source1 (R15_U_Current_Source1#2.1), U_High_Level_Connections/U_Curr_Source_Buffer/U_Current_Source2 (R15_U_Current_Source2#2.1), U_High_Level_Connections/U_Curr_Source_Buffer/U_Current_Source3 (R15_U_Current_Source3#2.1), U_High_Level_Connections/U_Curr_Source_Buffer/U_Current_Source4 (R15_U_Current_Source4#2.1)
CS_MID: U_High_Level_Connections/U_Curr_Source_Buffer/U_Current_Source1 (R11_U_Current_Source1.2), U_High_Level_Connections/U_Curr_Source_Buffer/U_Current_Source2 (R11_U_Current_Source2.2), U_High_Level_Connections/U_Curr_Source_Buffer/U_Current_Source3 (R11_U_Current_Source3.2), U_High_Level_Connections/U_Curr_Source_Buffer/U_Current_Source4 (R11_U_Current_Source4.2)
CS_OUT: U_High_Level_Connections/U_Curr_Source_Buffer/U_Current_Source1 (R12_U_Current_Source1.1 U12_U_Current_Source1.3), U_High_Level_Connections/U_Curr_Source_Buffer/U_Current_Source2 (R12_U_Current_Source2.1 U12_U_Current_Source2.3), U_High_Level_Connections/U_Curr_Source_Buffer/U_Current_Source3 (R12_U_Current_Source3.1 U12_U_Current_Source3.3), U_High_Level_Connections/U_Curr_Source_Buffer/U_Current_Source4 (R12_U_Current_Source4.1 U12_U_Current_Source4.3)
DDS_CLK: U_High_Level_Connections/U_Four_DDS/U_Small_DDS1 (U8_U_Small_DDS1.5), U_High_Level_Connections/U_Four_DDS/U_Small_DDS2 (U8_U_Small_DDS2.5), U_High_Level_Connections/U_Four_DDS/U_Small_DDS3 (U8_U_Small_DDS3.5), U_High_Level_Connections/U_Four_DDS/U_Small_DDS4 (U8_U_Small_DDS4.5)
DDS_SCLK: U_High_Level_Connections/U_Four_DDS/U_Small_DDS1 (U8_U_Small_DDS1.7), U_High_Level_Connections/U_Four_DDS/U_Small_DDS2 (U8_U_Small_DDS2.7), U_High_Level_Connections/U_Four_DDS/U_Small_DDS3 (U8_U_Small_DDS3.7), U_High_Level_Connections/U_Four_DDS/U_Small_DDS4 (U8_U_Small_DDS4.7), MCU (U1#2.GP18)
DDS_SDAT: U_High_Level_Connections/U_Four_DDS/U_Small_DDS1 (U8_U_Small_DDS1.6), U_High_Level_Connections/U_Four_DDS/U_Small_DDS2 (U8_U_Small_DDS2.6), U_High_Level_Connections/U_Four_DDS/U_Small_DDS3 (U8_U_Small_DDS3.6), U_High_Level_Connections/U_Four_DDS/U_Small_DDS4 (U8_U_Small_DDS4.6), MCU (U1#2.GP19)
FROM_BRAIN: U_High_Level_Connections/U_Stimulus_Feedback/U_Current_Measure1 (R7_U_Current_Measure1.1 U2_U_Current_Measure1.2), U_High_Level_Connections/U_Stimulus_Feedback/U_Current_Measure2 (R7_U_Current_Measure2.1 U2_U_Current_Measure2.2), U_High_Level_Connections/U_Stimulus_Feedback/U_Current_Measure3 (R7_U_Current_Measure3.1 U2_U_Current_Measure3.2), U_High_Level_Connections/U_Stimulus_Feedback/U_Current_Measure4 (R7_U_Current_Measure4.1 U2_U_Current_Measure4.2)
FSYNC: U_High_Level_Connections/U_Four_DDS/U_Small_DDS1 (U8_U_Small_DDS1.8), U_High_Level_Connections/U_Four_DDS/U_Small_DDS2 (U8_U_Small_DDS2.8), U_High_Level_Connections/U_Four_DDS/U_Small_DDS3 (U8_U_Small_DDS3.8), U_High_Level_Connections/U_Four_DDS/U_Small_DDS4 (U8_U_Small_DDS4.8)
MP_~{CS}: Curr_Source_Buffer (U18.4), MCU (U1#2.GP27_A1)
MP_U/~{D}: Curr_Source_Buffer (U18.3), MCU (U1#2.GP28_A2)
NetU6_U_PGA_Block1_1: U_High_Level_Connections/U_Programmable_Gain_Amp/U_PGA_Block1 (U6_U_PGA_Block1.1), U_High_Level_Connections/U_Programmable_Gain_Amp/U_PGA_Block2 (U6_U_PGA_Block2.1), U_High_Level_Connections/U_Programmable_Gain_Amp/U_PGA_Block3 (U6_U_PGA_Block3.1), U_High_Level_Connections/U_Programmable_Gain_Amp/U_PGA_Block4 (U6_U_PGA_Block4.1)
NetU6_U_PGA_Block1_2: U_High_Level_Connections/U_Programmable_Gain_Amp/U_PGA_Block1 (U6_U_PGA_Block1.2), U_High_Level_Connections/U_Programmable_Gain_Amp/U_PGA_Block2 (U6_U_PGA_Block2.2), U_High_Level_Connections/U_Programmable_Gain_Amp/U_PGA_Block3 (U6_U_PGA_Block3.2), U_High_Level_Connections/U_Programmable_Gain_Amp/U_PGA_Block4 (U6_U_PGA_Block4.2)
NetU6_U_PGA_Block1_5: U_High_Level_Connections/U_Programmable_Gain_Amp/U_PGA_Block1 (U6_U_PGA_Block1.5), U_High_Level_Connections/U_Programmable_Gain_Amp/U_PGA_Block2 (U6_U_PGA_Block2.5), U_High_Level_Connections/U_Programmable_Gain_Amp/U_PGA_Block3 (U6_U_PGA_Block3.5), U_High_Level_Connections/U_Programmable_Gain_Amp/U_PGA_Block4 (U6_U_PGA_Block4.5)
PGA_SCK: U_High_Level_Connections/U_Programmable_Gain_Amp/U_PGA_Block1 (U6_U_PGA_Block1.7), U_High_Level_Connections/U_Programmable_Gain_Amp/U_PGA_Block2 (U6_U_PGA_Block2.7), U_High_Level_Connections/U_Programmable_Gain_Amp/U_PGA_Block3 (U6_U_PGA_Block3.7), U_High_Level_Connections/U_Programmable_Gain_Amp/U_PGA_Block4 (U6_U_PGA_Block4.7), MCU (U1#2.GP10)
PGA_SI: U_High_Level_Connections/U_Programmable_Gain_Amp/U_PGA_Block1 (U6_U_PGA_Block1.6), U_High_Level_Connections/U_Programmable_Gain_Amp/U_PGA_Block2 (U6_U_PGA_Block2.6), U_High_Level_Connections/U_Programmable_Gain_Amp/U_PGA_Block3 (U6_U_PGA_Block3.6), U_High_Level_Connections/U_Programmable_Gain_Amp/U_PGA_Block4 (U6_U_PGA_Block4.6), MCU (U1#2.GP11)
SIN_OUT: U_High_Level_Connections/U_Four_DDS/U_Small_DDS1 (U8_U_Small_DDS1.10), U_High_Level_Connections/U_Four_DDS/U_Small_DDS2 (U8_U_Small_DDS2.10), U_High_Level_Connections/U_Four_DDS/U_Small_DDS3 (U8_U_Small_DDS3.10), U_High_Level_Connections/U_Four_DDS/U_Small_DDS4 (U8_U_Small_DDS4.10)
TF_LOW: U_High_Level_Connections/U_Stimulus_Feedback/U_Current_Measure1 (R7_U_Current_Measure1.2 U2_U_Current_Measure1.3), U_High_Level_Connections/U_Stimulus_Feedback/U_Current_Measure2 (R7_U_Current_Measure2.2 U2_U_Current_Measure2.3), U_High_Level_Connections/U_Stimulus_Feedback/U_Current_Measure3 (R7_U_Current_Measure3.2 U2_U_Current_Measure3.3), U_High_Level_Connections/U_Stimulus_Feedback/U_Current_Measure4 (R7_U_Current_Measure4.2 U2_U_Current_Measure4.3)

## Assembly variants
Not Fitted: all parts fitted